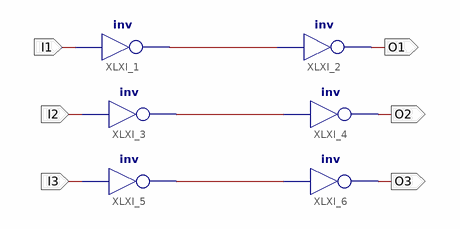
[diagram p0: schematic sheet 1]
// Xilinx ISE schematic lab5_1.sch (spartan6) as structural Verilog: 6 symbols, 6 ports
module lab5_1 (
  input  I1,
  input  I2,
  input  I3,
  output O1,
  output O2,
  output O3
);

  wire XLXN_5, XLXN_8, XLXN_11;

  not XLXI_1 (XLXN_5, I1);
  not XLXI_2 (O1, XLXN_5);
  not XLXI_3 (XLXN_8, I2);
  not XLXI_4 (O2, XLXN_8);
  not XLXI_5 (XLXN_11, I3);
  not XLXI_6 (O3, XLXN_11);
endmodule
